# EAGLE design ProtoCAT (EAGLE 6.5.0)
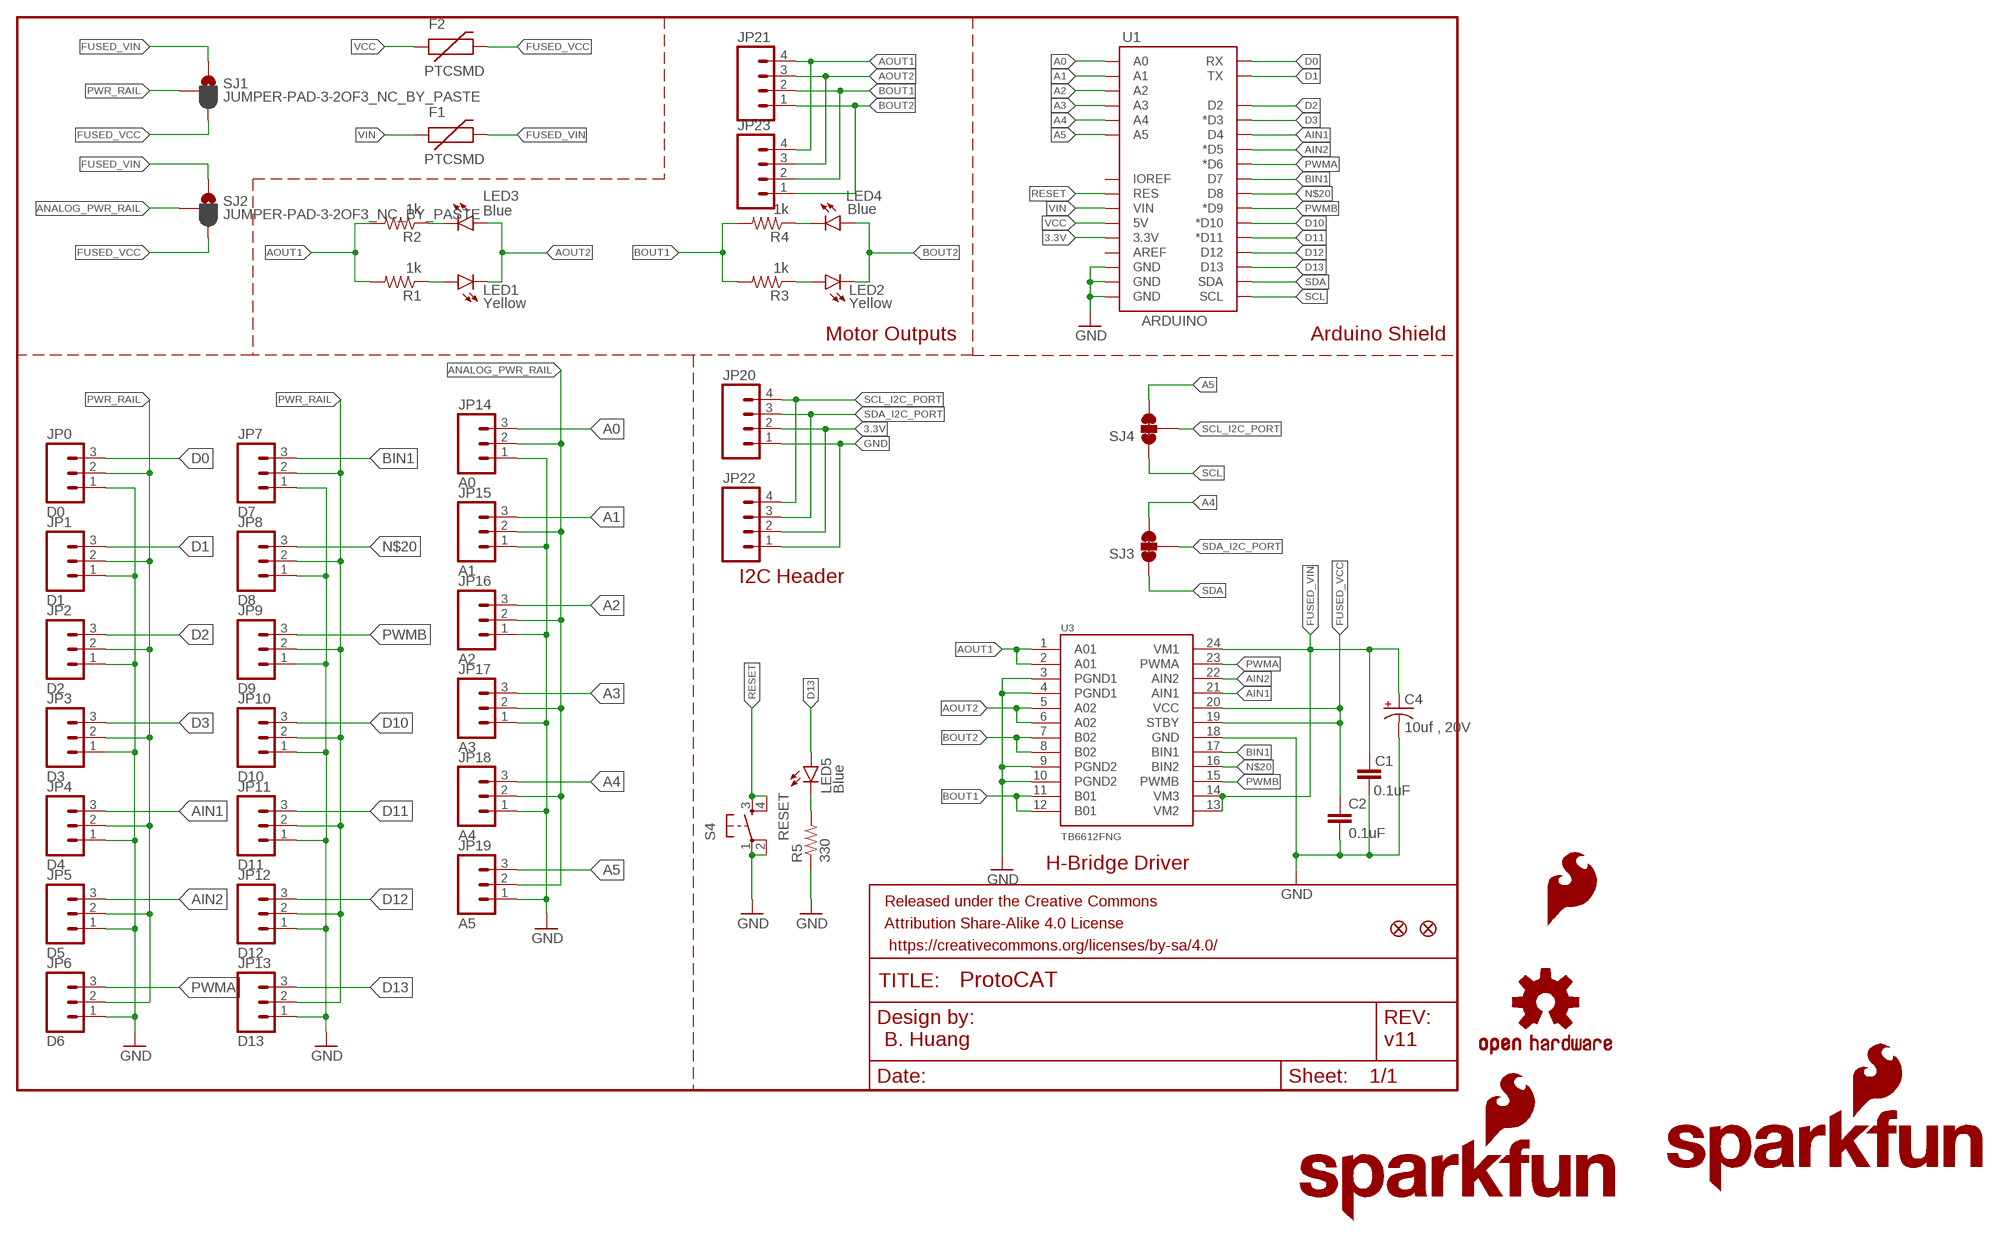
[diagram p0: schematic, sheet 1]

## Parts
C1  0.1uF  0.1UF-25V-5%(0603)  [0603-CAP]
C2  0.1uF  0.1UF-25V-5%(0603)  [0603-CAP]
C4  10uf , 20V  10UF-20V-10%(TANT)  [EIA3528]
F1  PTCSMD  [PTC-1206]
F2  PTCSMD  [PTC-1206]
FID1  FIDUCIAL1X2  [FIDUCIAL-1X2]
FID2  FIDUCIAL1X2  [FIDUCIAL-1X2]
FRAME1  FRAME-LETTER  [CREATIVE_COMMONS]
JP0  D0  M03LOCK  [1X03_LOCK]
JP1  D1  M03LOCK  [1X03_LOCK]
JP2  D2  M03LOCK  [1X03_LOCK]
JP3  D3  M03LOCK  [1X03_LOCK]
JP4  D4  M03LOCK  [1X03_LOCK]
JP5  D5  M03LOCK  [1X03_LOCK]
JP6  D6  M03LOCK  [1X03_LOCK]
JP7  D7  M03LOCK  [1X03_LOCK]
JP8  D8  M03LOCK  [1X03_LOCK]
JP9  D9  M03LOCK  [1X03_LOCK]
JP10  D10  M03LOCK  [1X03_LOCK]
JP11  D11  M03LOCK  [1X03_LOCK]
JP12  D12  M03LOCK  [1X03_LOCK]
JP13  D13  M03LOCK  [1X03_LOCK]
JP14  A0  M03LOCK  [1X03_LOCK]
JP15  A1  M03LOCK  [1X03_LOCK]
JP16  A2  M03LOCK  [1X03_LOCK]
JP17  A3  M03LOCK  [1X03_LOCK]
JP18  A4  M03LOCK  [1X03_LOCK]
JP19  A5  M03LOCK  [1X03_LOCK]
JP20  M04SMD_STRAIGHT_COMBO  [1X04_SMD_STRAIGHT_COMBO]
JP21  M04PTH  [1X04]
JP22  M04PTH  [1X04]
JP23  M04SMD_STRAIGHT_COMBO  [1X04_SMD_STRAIGHT_COMBO]
LED1  Yellow  LED0603  [LED-0603]
LED2  Yellow  LED0603  [LED-0603]
LED3  Blue  LED0603  [LED-0603]
LED4  Blue  LED0603  [LED-0603]
LED5  Blue  LED0603  [LED-0603]
LOGO1  OSHW-LOGOM  [OSHW-LOGO-M]
LOGO2  SFE_LOGO_NAME_FLAME.1_INCH  [SFE_LOGO_NAME_FLAME_.1]
LOGO3  SFE_LOGO_FLAME.2COP  [SFE_LOGO_FLAME_COPPER_.2]
LOGO4  SFE_LOGO_NAME_FLAME.1_INCH  [SFE_LOGO_NAME_FLAME_.1]
R1  1k  1KOHM1/10W1%(0603)  [0603-RES]
R2  1k  1KOHM1/10W1%(0603)  [0603-RES]
R3  1k  1KOHM1/10W1%(0603)  [0603-RES]
R4  1k  1KOHM1/10W1%(0603)  [0603-RES]
R5  330  330OHM1/10W1%(0603)  [0603-RES]
S4  RESET  TAC_SWITCHSMD  [TACTILE-SWITCH-SMD]
SJ1  JUMPER-PAD-3-2OF3_NC_BY_PASTE  [PAD-JUMPER-3-2OF3_NC_BY_PASTE_YES_SILK_FULL_BOX]
SJ2  JUMPER-PAD-3-2OF3_NC_BY_PASTE  [PAD-JUMPER-3-2OF3_NC_BY_PASTE_YES_SILK_FULL_BOX]
SJ3  JUMPER-PAD-3-NC_BY_TRACE  [PAD-JUMPER-3-3OF3_NC_BY_TRACE_YES_SILK_FULL_BOX]
SJ4  JUMPER-PAD-3-NC_BY_TRACE  [PAD-JUMPER-3-3OF3_NC_BY_TRACE_YES_SILK_FULL_BOX]
U1  ARDUINO  ARDUINO_R3_SHIELDNOLABELS  [UNO_R3_SHIELD_NOLABELS]
U3  TB6612FNG  [SSOP24]
U$1  SFE_LUDUS  [SFE_LUDUS-M]

## Nets
3.3V: JP20.2 JP22.2 U1.3.3V
A0: JP14.3 U1.A0
A1: JP15.3 U1.A1
A2: JP16.3 U1.A2
A3: JP17.3 U1.A3
A4: JP18.3 SJ3.3 U1.A4
A5: JP19.3 SJ4.3 U1.A5
AIN1: JP4.3 U1.D4 U3.21(AIN1)
AIN2: JP5.3 U1.D5(*D5) U3.22(AIN2)
ANALOG_PWR_RAIL: JP14.2 JP15.2 JP16.2 JP17.2 JP18.2 JP19.2 SJ2.2
AOUT1: JP21.4 JP23.4 R1.2 R2.2 U3.1(A01) U3.2(A01)
AOUT2: JP21.3 JP23.3 LED1.C LED3.A U3.5(A02) U3.6(A02)
BIN1: JP7.3 U1.D7 U3.17(BIN1)
BOUT1: JP21.2 JP23.2 R3.2 R4.2 U3.11(B01) U3.12(B01)
BOUT2: JP21.1 JP23.1 LED2.C LED4.A U3.7(B02) U3.8(B02)
D0: JP0.3 U1.RX
D1: JP1.3 U1.TX
D2: JP2.3 U1.D2
D3: JP3.3 U1.D3(*D3)
D10: JP10.3 U1.D10(*D10)
D11: JP11.3 U1.D11(*D11)
D12: JP12.3 U1.D12
D13: JP13.3 LED5.A U1.D13
FUSED_VCC: C2.1 F2.2 SJ1.3 SJ2.3 U3.19(STBY) U3.20(VCC)
FUSED_VIN: C1.1 C4.A(+) F1.2 SJ1.1 SJ2.1 U3.13(VM2) U3.14(VM3) U3.24(VM1)
GND: C1.2 C2.2 C4.C(-) JP0.1 JP1.1 JP2.1 JP3.1 JP4.1 JP5.1 JP6.1 JP7.1 JP8.1 JP9.1 JP10.1 JP11.1 JP12.1 JP13.1 JP14.1 JP15.1 JP16.1 JP17.1 JP18.1 JP19.1 JP20.1 JP22.1 R5.1 S4.1 S4.2 U1.GND@0(GND) U1.GND@1(GND) U1.GND@2(GND) U3.3(PGND1) U3.4(PGND1) U3.9(PGND2) U3.10(PGND2) U3.18(GND)
N$1: LED5.C R5.2
N$4: LED1.A R1.1
N$5: LED3.C R2.1
N$8: LED2.A R3.1
N$9: LED4.C R4.1
N$20: JP8.3 U1.D8 U3.16(BIN2)
PWMA: JP6.3 U1.D6(*D6) U3.23(PWMA)
PWMB: JP9.3 U1.D9(*D9) U3.15(PWMB)
PWR_RAIL: JP0.2 JP1.2 JP2.2 JP3.2 JP4.2 JP5.2 JP6.2 JP7.2 JP8.2 JP9.2 JP10.2 JP11.2 JP12.2 JP13.2 SJ1.2
RESET: S4.3 S4.4 U1.RES
SCL: SJ4.1 U1.SCL
SCL_I2C_PORT: JP20.4 JP22.4 SJ4.2
SDA: SJ3.1 U1.SDA
SDA_I2C_PORT: JP20.3 JP22.3 SJ3.2
VCC: F2.1 U1.5V
VIN: F1.1 U1.VIN
Unconnected: U1.AREF U1.IOREF

## Notes on the sheet
- Motor Outputs | Arduino Shield
- I2C Header
- H-Bridge Driver
- B. Huang | v11

## Library data of the parts
C1 C2 = SparkFun-Capacitors:0.1UF-25V-5%(0603): CAP-08604; PROD_ID: CAP-08604
C4 = SparkFun-Capacitors:10UF-20V-10%(TANT): CAP-08063; PROD_ID: CAP-08063; VALUE: 10uF
F1 F2 = SparkFun-PowerIC:PTC: Resettable Fuse PTC Resettable Fuse. Spark Fun Electronics SKU : COM-08357; PROD_ID: RES-11150
FID1 FID2 = SparkFun-Aesthetics:FIDUCIAL: Fiducial Alignment Points Various fiducial points for machine vision alignment.
FRAME1 = SparkFun-Aesthetics:FRAME-LETTER: Schematic Frame Standard 8.5x11 US Letter frame
JP0 JP1-JP19 = SparkFun-Connectors:M03: Header 3 Standard 3-pin 0.1" header. Use with straight break away headers (SKU : PRT-00116), right angle break away headers (PRT-00553), swiss pins (PRT-00743), machine pins (PRT-00117), and female headers (PRT-00115). Molex polarized connector foot print use with SKU : PRT-08232 with associated crimp pins and housings.
JP20 JP23 = SparkFun-Connectors:M04: Header 4 Standard 4-pin 0.1" header. Use with straight break away headers (SKU : PRT-00116), right angle break away headers (PRT-00553), swiss pins (PRT-00743), machine pins (PRT-00117), and female headers (PRT-00115). Molex polarized connector foot print use with SKU : PRT-08231 with associated crimp pins and housings. 1MM SMD Version SKU: PRT-10208; PROD_ID: CONN-08511; VALUE: 1X04_SMD_STRAIGHT_COMBO
JP21 JP22 = SparkFun-Connectors:M04: Header 4 Standard 4-pin 0.1" header. Use with straight break away headers (SKU : PRT-00116), right angle break away headers (PRT-00553), swiss pins (PRT-00743), machine pins (PRT-00117), and female headers (PRT-00115). Molex polarized connector foot print use with SKU : PRT-08231 with associated crimp pins and housings. 1MM SMD Version SKU: PRT-10208
LED1-LED5 = SparkFun-LED:LED: LEDs Standard schematic elements and footprints for 5mm, 3mm, 1206, and 0603 sized LEDs. 5mm - Spark Fun Electronics SKU : COM-00529 (and others)
LOGO1 = SparkFun-Aesthetics:OSHW-LOGO: Open Source Hardware Logo This logo indicates the piece of hardware it is found on incorporates a OSHW license and/or adheres to the definition of open source hardware found here: http://freedomdefined.org/OSHW
LOGO2 LOGO4 = SparkFun-Aesthetics:SFE_LOGO_NAME_FLAME: SFE Logo, name and flame This is the SparkFun full logo. The logo on the schematic will always be the same size; the package variant is the height of the flame part of the logo. Default layer for the logo on the board is tSilk.
LOGO3 = SparkFun-Aesthetics:SFE_LOGO_FLAME: SFE Logo, flame only This is the SparkFun flame logo. The logo on the schematic will always be the same size; the package variant is the height of the flame. Default layer for the logo on the board is tSilk.
R1-R4 = SparkFun-Resistors:1KOHM1/10W1%(0603): RES-07856; PROD_ID: RES-07856; VALUE: 1K
R5 = SparkFun-Resistors:330OHM1/10W1%(0603): RES-00818; PROD_ID: RES-00818
S4 = SparkFun-Electromechanical:TAC_SWITCH: Momentary Switch Button commonly used for reset or general input. Spark Fun Electronics SKU : COM-00097 SMT- SWCH-08247; PROD_ID: SWCH-08247; VALUE: TAC_SWITCHSMD
SJ1 SJ2 = SparkFun-Passives:JUMPER-PAD-3-2OF3_NC_BY_PASTE
SJ3 SJ4 = SparkFun-Passives:JUMPER-PAD-3-NC_BY_TRACE
U1 = SparkFun-Boards:ARDUINO_R3_SHIELD: Shield form compatible with the Arduino Uno R3.
U3 = SparkFun-PowerIC:TB6612FNG: Toshiba 1A dual motor driver IC-09363; PROD_ID: IC-09363
U$1 = SparkFun-Aesthetics:SFE_LUDUS

## Net classes
1 power: width 0.61 mm

## Board
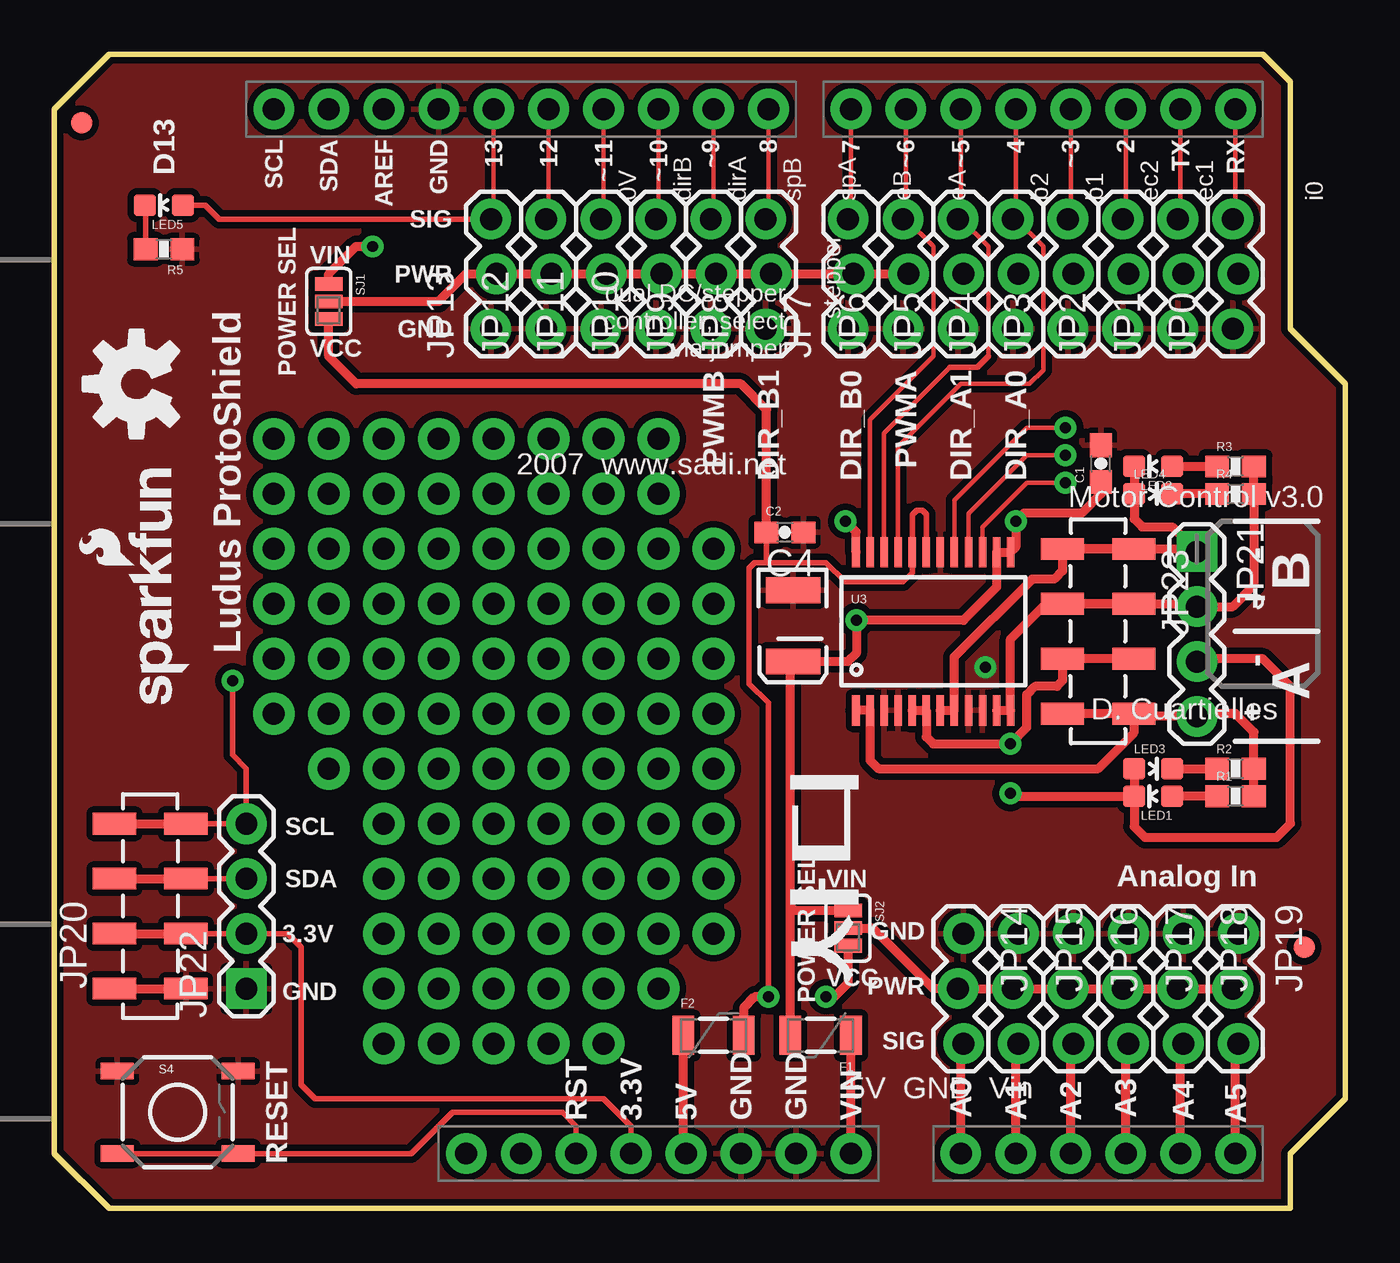
[diagram p1: board, top side]
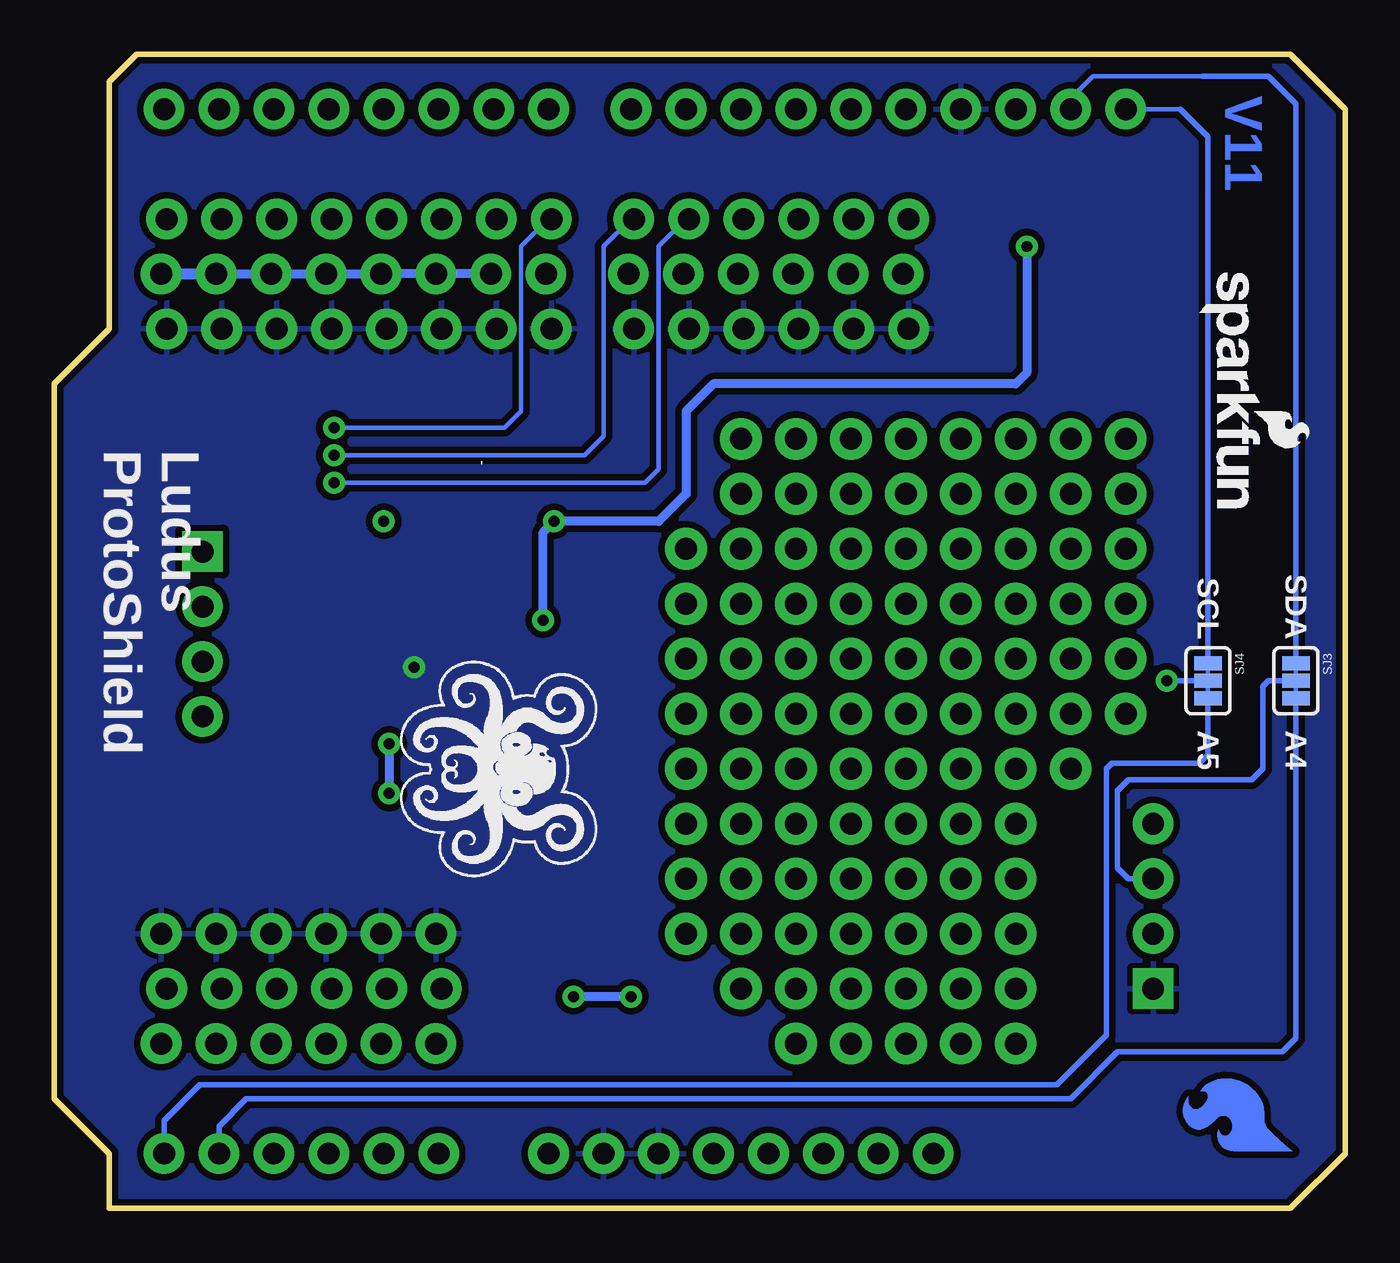
[diagram p2: board, bottom side, seen from below]

Size 59.69 x 53.34 mm. Coordinates in mm from the lower left corner, seen from the top.
Outline: 0,50.8 0,2.54 2.54,0 57.15,0 57.15,2.54 59.69,5.08 59.69,38.1 57.15,40.64 57.15,52.07 55.88,53.34 2.54,53.34 0,50.8
Copper layers (1*16): Top 0.035mm / dielectric 1.5mm / Bottom 0.035mm
Design rules "SparkFun-2-layer": minimum track width 7mil, minimum drill 15mil, track to track 8mil, track to pad 8mil, pad to pad 8mil, via to via 8mil, smd to smd 8mil, copper to edge 8mil, drill to drill 8mil, minimum pad ring 12mil, minimum via ring 10mil, stop-mask expansion 4mil, vias tented up to drill 20mil, thermal gap 10mil

### Footprints (pad centres in the part's own frame; a part is rotated, then mirrored left to right if it is on the bottom)
0603-CAP = smd 1.1 x 1: 1 -0.85,0; 2 0.85,0
EIA3528 = smd 1.2 x 2.5: A 1.65,0; C -1.65,0
PTC-1206 = smd 1 x 1.8: 1 -1.4,0; 2 1.4,0
FIDUCIAL-1X2 = smd 1 x 1: 1 0,0
1X03_LOCK = drill 1.016 pad 1.88: 1 0,0.127; 2 2.54,-0.127; 3 5.08,0.127
1X04_SMD_STRAIGHT_COMBO = smd 1 x 2: 1 0,-1.65; 1-2 0,1.65; 2 2.54,1.65; 2-2 2.54,-1.65; 3 5.08,-1.65; 3-2 5.08,1.65; 4 7.62,1.65; 4-2 7.62,-1.65
1X04 = drill 1.016 pad 1.88 square: 1 0,0 | drill 1.016 pad 1.88: 2 2.54,0; 3 5.08,0; 4 7.62,0
LED-0603 = smd 1 x 1: A 0,-0.877; C 0,0.877
0603-RES = smd 1.1 x 1: 1 -0.85,0; 2 0.85,0
TACTILE-SWITCH-SMD = smd 1.524 x 0.762: 1 -2.794,1.905; 2 2.794,1.905; 3 -2.794,-1.905; 4 2.794,-1.905
PAD-JUMPER-3-2OF3_NC_BY_PASTE_YES_SILK_FULL_BOX = smd 0.635 x 1.27: 1 -0.813,0; 2 0,0; 3 0.813,0
PAD-JUMPER-3-3OF3_NC_BY_TRACE_YES_SILK_FULL_BOX = smd 0.635 x 1.27: 1 -0.813,0; 2 0,0; 3 0.813,0
UNO_R3_SHIELD_NOLABELS = drill 1.016 pad 1.88: 3.3V 50.8,26.67; 5V 50.8,29.21; A0 50.8,41.91; A1 50.8,44.45; A2 50.8,46.99; A3 50.8,49.53; A4 50.8,52.07; A5 50.8,54.61; AREF 2.54,15.24; D2 2.54,49.53; D3 2.54,46.99; D4 2.54,44.45; D5 2.54,41.91; D6 2.54,39.37; D7 2.54,36.83; D8 2.54,33.02; D9 2.54,30.48; D10 2.54,27.94; D11 2.54,25.4; D12 2.54,22.86; D13 2.54,20.32; GND@0 50.8,31.75; GND@1 50.8,34.29; GND@2 2.54,17.78; IOREF 50.8,21.59; NC 50.8,19.05; RES 50.8,24.13; RX 2.54,54.61; SCL 2.54,10.16; SDA 2.54,12.7; TX 2.54,52.07; VIN 50.8,36.83
SSOP24 = smd 0.348 x 1.397: 1 -3.575,-3.656; 2 -2.925,-3.656; 3 -2.275,-3.656; 4 -1.625,-3.656; 5 -0.975,-3.656; 6 -0.325,-3.656; 7 0.325,-3.656; 8 0.975,-3.656; 9 1.625,-3.656; 10 2.275,-3.656; 11 2.925,-3.656; 12 3.575,-3.656; 13 3.575,3.656; 14 2.925,3.656; 15 2.275,3.656; 16 1.625,3.656; 17 0.975,3.656; 18 0.325,3.656; 19 -0.325,3.656; 20 -0.975,3.656; 21 -1.625,3.656; 22 -2.275,3.656; 23 -2.925,3.656; 24 -3.575,3.656

### Placement (x,y rotation side)
C1  48.39,34.42 90 top
C2  33.78,31.24 0 top
C4  34.16,26.92 270 top
F1  35.43,8 180 top
F2  30.48,8 0 top
FID1  1.27,50.16 0 top
FID2  57.78,12.06 0 top
FRAME1  21.59,-12.7 0 top  (outside the outline)
JP0  54.61,40.64 90 top
JP1  52.07,40.64 90 top
JP2  49.53,40.64 90 top
JP3  46.99,40.64 90 top
JP4  44.45,40.64 90 top
JP5  41.91,40.64 90 top
JP6  39.37,40.64 90 top
JP7  36.83,40.64 90 top
JP8  33.02,40.64 90 top
JP9  30.48,40.64 90 top
JP10  27.94,40.64 90 top
JP11  25.4,40.64 90 top
JP12  22.86,40.64 90 top
JP13  20.32,40.64 90 top
JP14  41.91,12.7 270 top
JP15  44.45,12.7 270 top
JP16  46.99,12.7 270 top
JP17  49.53,12.7 270 top
JP18  52.07,12.7 270 top
JP19  54.61,12.7 270 top
JP20  4.45,10.16 90 top
JP21  52.83,30.35 270 top
JP22  8.89,10.16 90 top
JP23  48.26,30.48 270 top
LED1  50.8,19.05 90 top
LED2  50.8,34.29 90 top
LED3  50.8,20.32 270 top
LED4  50.8,33.02 270 top
LED5  5.08,46.35 90 top
LOGO1  3.81,38.1 90 top
LOGO2  6.35,22.86 90 top
LOGO3  2.16,2.29 90 bottom
LOGO4  6.86,43.69 270 bottom
R1  54.61,19.05 0 top
R2  54.61,20.32 0 top
R3  54.61,34.29 0 top
R4  54.61,33.02 0 top
R5  5.08,44.32 180 top
S4  5.71,4.45 0 top
SJ1  12.7,41.91 270 top
SJ2  36.7,12.95 270 top
SJ3  2.29,24.38 270 bottom
SJ4  6.35,24.38 270 bottom
U1  0,53.34 270 top
U3  40.64,26.67 0 top
U$1  39.37,20.32 90 top

### Tracks (layer width: path | path; a pad name or v marks a point on that pad's centre or on a via)
3.3V
  Top 0.254: U1.3.3V 26.67,3.81 25.4,5.08 12.06,5.08 11.43,5.71 11.43,12.06 10.79,12.7 JP22.2 JP20.2
A0
  Top 0.406: U1.A0 41.91,7.49 JP14.3
A1
  Top 0.406: U1.A1 44.45,7.49 JP15.3
A2
  Top 0.406: U1.A2 46.99,7.49 JP16.3
A3
  Top 0.406: U1.A3 49.53,7.49 JP17.3
A4
  Top 0.406: U1.A4 52.07,7.49 JP18.3
  Bottom 0.254: U1.A4 52.07,3.81 50.8,5.08 12.7,5.08 10.54,7.24 2.92,7.24 2.29,7.87 SJ3.3
A5
  Top 0.406: U1.A5 54.61,7.49 JP19.3
  Bottom 0.254: U1.A5 54.61,4.06 52.96,5.71 13.34,5.71 11.05,8 11.05,20.32 10.79,20.57 6.73,20.57 6.35,20.95 SJ4.3
AIN1
  Top 0.203: U3.21 39.02,35.2 41.91,38.1 45.09,38.1 45.72,38.73 45.72,44.45 44.45,45.72 JP4.3 44.45,45.85 U1.D4
AIN2
  Top 0.203: U3.22 38.37,35.83 41.4,38.86 | 43.18,39.37 43.18,44.45 41.91,45.72 JP5.3 41.91,45.85 U1.D5
  Top 0.254: 43.18,39.37 42.67,38.86 41.4,38.86
ANALOG_PWR_RAIL
  Top 0.406: JP19.2 JP18.2 JP17.2 JP16.2 JP15.2 JP14.2 40.64,10.16 37.85,12.95 SJ2.2
AOUT1
  Top 0.254: 55.24,18.84 R1.2
  Top 0.406: R1.2 R2.2 55.46,22.01 54.61,22.86 52.96,22.86 JP21.4 50.04,22.73 JP23.4 49.91,21.97 48.26,20.32 38.1,20.32 37.72,20.7 U3.2 U3.1
AOUT2  (via drill 0.51)
  Top 0.406: LED3.A LED1.C | LED1.C 49.92,17.64 50.42,17.14 56.52,17.14 57.15,17.78 57.15,24.13 55.88,25.4 52.96,25.4 JP21.3 | U3.5 U3.6 40.31,21.79 40.64,21.46 v44.2,21.46 44.96,22.23 44.96,23.75 45.34,24.13 46.35,24.13 46.61,24.39 JP23.3 | v44.2,19.18 44.32,19.05 LED1.C
  Bottom 0.406: v44.2,21.46 v44.2,19.18
BIN1  (via drill 0.51)
  Top 0.203: U3.17 41.62,32.73 44.96,36.07 v46.76,36.07 | U1.D7 36.83,45.85 JP7.3
  Bottom 0.203: v46.76,36.07 38.86,36.07 38.1,36.83 38.1,44.45 36.83,45.72 JP7.3
BOUT1
  Top 0.406: R3.2 R4.2 55.46,28.79 54.48,27.81 JP21.2 52.7,27.94 JP23.2 45.85,27.94 44.22,26.31 U3.12 U3.11
BOUT2
  Top 0.406: U3.7 U3.8 41.62,25.49 45.21,29.08 46.23,29.08 46.61,29.46 JP23.1 52.7,30.48 JP21.1 51.69,31.5 50.29,31.5 49.92,31.86 LED4.A LED2.C
D0
  Top 0.203: U1.RX 54.61,45.85 JP0.3
D1
  Top 0.203: U1.TX 52.07,45.85 JP1.3
D2
  Top 0.203: U1.D2 49.53,45.85 JP2.3
D3
  Top 0.203: U1.D3 46.99,45.85 JP3.3
D10
  Top 0.203: U1.D10 27.94,45.85 JP10.3
D11
  Top 0.203: U1.D11 25.4,45.85 JP11.3
D12
  Top 0.203: U1.D12 22.86,45.85 JP12.3
D13
  Top 0.203: U1.D13 20.32,45.85 JP13.3
  Top 0.254: LED5.A 6.99,46.35 7.62,45.72 JP13.3
FUSED_VCC  (via drill 0.51)
  Top 0.254: v33.02,9.78 33.02,23.37 32.13,24.26 32.13,29.59 32.38,29.84 33.02,29.84 | 33.02,29.84 35.69,29.84 36.58,28.96 39.24,28.96 39.66,29.38 U3.20 39.66,32.05 39.88,32.26 40.13,32.26 40.31,32.08 U3.19 | C2.1 32.93,29.93 33.02,29.84
  Top 0.406: F2.2 31.88,9.27 32.38,9.78 v33.02,9.78 | v35.69,9.78 36.07,9.78 36.7,10.41 SJ2.3 | C2.1 32.93,36.92 31.75,38.1 13.97,38.1 12.7,39.37 SJ1.3
  Bottom 0.406: v33.02,9.78 v35.69,9.78
FUSED_VIN  (via drill 0.51)
  Top 0.406: C1.1 48.39,33.02 47.5,32.13 44.83,32.13 v44.45,31.75 44.45,30.56 U3.13 U3.14 43.56,28.71 42.04,27.18 v37.08,27.18 37.08,25.65 36.7,25.27 C4.A 34.03,25.14 34.03,13.97 | SJ1.1 12.7,43.18 13.97,44.45 v14.73,44.45 | F1.2 34.03,13.97 | U3.24 37.06,31.26 v36.58,31.75 | SJ2.1 34.24,13.77 34.03,13.97
  Bottom 0.406: v14.73,44.45 14.73,38.61 15.24,38.1 29.21,38.1 30.48,36.83 30.48,33.02 31.75,31.75 v36.58,31.75 37.08,31.24 v37.08,27.18
GND  (via drill 0.51)
  other vias: 43.05,25.02
  pour Top (isolate 0.305): 0,53.34 0,0 59.69,0 59.69,53.34
  pour Bottom (isolate 0.305): 0,0 59.69,0 59.69,53.34 0,53.34
N$1
  Top 0.254: R5.2 4.23,46.33 LED5.C
N$2  (via drill 1.02 pad 1.93)
  other vias: 25.4,35.56
N$3  (via drill 1.02 pad 1.93)
  other vias: 25.4,33.02
N$4
  Top 0.406: R1.1 LED1.A
N$5
  Top 0.406: LED3.C R2.1
N$6  (via drill 1.02 pad 1.93)
  other vias: 25.4,30.48
N$7  (via drill 1.02 pad 1.93)
  other vias: 22.86,30.48
N$8
  Top 0.406: LED2.A R3.1
N$9
  Top 0.406: R4.1 LED4.C
N$10  (via drill 1.02 pad 1.93)
  other vias: 22.86,33.02
N$11  (via drill 1.02 pad 1.93)
  other vias: 22.86,35.56
N$12  (via drill 1.02 pad 1.93)
  other vias: 20.32,35.56
N$13  (via drill 1.02 pad 1.93)
  other vias: 17.78,35.56
N$14  (via drill 1.02 pad 1.93)
  other vias: 15.24,35.56
N$15  (via drill 1.02 pad 1.93)
  other vias: 12.7,35.56
N$16  (via drill 1.02 pad 1.93)
  other vias: 10.16,35.56
N$17  (via drill 1.02 pad 1.93)
  other vias: 27.94,35.56
N$18  (via drill 1.02 pad 1.93)
  other vias: 12.7,20.32
N$19  (via drill 1.02 pad 1.93)
  other vias: 27.94,10.16
N$20  (via drill 0.51)
  Top 0.203: U3.16 42.27,32.1 44.96,34.8 v46.76,34.8 | U1.D8 33.02,45.85 JP8.3
  Bottom 0.203: v46.76,34.8 35.18,34.8 34.29,35.69 34.29,44.45 33.02,45.72 JP8.3
N$23  (via drill 1.02 pad 1.93)
  other vias: 10.16,22.86
N$24  (via drill 1.02 pad 1.93)
  other vias: 10.16,25.4
N$25  (via drill 1.02 pad 1.93)
  other vias: 12.7,25.4
N$26  (via drill 1.02 pad 1.93)
  other vias: 15.24,25.4
N$27  (via drill 1.02 pad 1.93)
  other vias: 17.78,25.4
N$28  (via drill 1.02 pad 1.93)
  other vias: 20.32,25.4
N$29  (via drill 1.02 pad 1.93)
  other vias: 22.86,25.4
N$30  (via drill 1.02 pad 1.93)
  other vias: 25.4,25.4
N$31  (via drill 1.02 pad 1.93)
  other vias: 27.94,25.4
N$32  (via drill 1.02 pad 1.93)
  other vias: 27.94,27.94
N$33  (via drill 1.02 pad 1.93)
  other vias: 27.94,30.48
N$34  (via drill 1.02 pad 1.93)
  other vias: 27.94,33.02
N$35  (via drill 1.02 pad 1.93)
  other vias: 25.4,27.94
N$36  (via drill 1.02 pad 1.93)
  other vias: 22.86,27.94
N$37  (via drill 1.02 pad 1.93)
  other vias: 20.32,27.94
N$38  (via drill 1.02 pad 1.93)
  other vias: 17.78,27.94
N$39  (via drill 1.02 pad 1.93)
  other vias: 15.24,27.94
N$40  (via drill 1.02 pad 1.93)
  other vias: 12.7,27.94
N$41  (via drill 1.02 pad 1.93)
  other vias: 10.16,27.94
N$42  (via drill 1.02 pad 1.93)
  other vias: 12.7,22.86
N$45  (via drill 1.02 pad 1.93)
  other vias: 10.16,33.02
N$46  (via drill 1.02 pad 1.93)
  other vias: 10.16,30.48
N$47  (via drill 1.02 pad 1.93)
  other vias: 12.7,30.48
N$48  (via drill 1.02 pad 1.93)
  other vias: 12.7,33.02
N$49  (via drill 1.02 pad 1.93)
  other vias: 15.24,33.02
N$50  (via drill 1.02 pad 1.93)
  other vias: 15.24,30.48
N$51  (via drill 1.02 pad 1.93)
  other vias: 17.78,30.48
N$52  (via drill 1.02 pad 1.93)
  other vias: 17.78,33.02
N$53  (via drill 1.02 pad 1.93)
  other vias: 20.32,33.02
N$54  (via drill 1.02 pad 1.93)
  other vias: 20.32,30.48
N$55  (via drill 1.02 pad 1.93)
  other vias: 15.24,22.86
N$56  (via drill 1.02 pad 1.93)
  other vias: 15.24,20.32
N$57  (via drill 1.02 pad 1.93)
  other vias: 15.24,17.78
N$58  (via drill 1.02 pad 1.93)
  other vias: 15.24,15.24
N$59  (via drill 1.02 pad 1.93)
  other vias: 15.24,12.7
N$60  (via drill 1.02 pad 1.93)
  other vias: 15.24,10.16
N$61  (via drill 1.02 pad 1.93)
  other vias: 15.24,7.62
N$62  (via drill 1.02 pad 1.93)
  other vias: 17.78,7.62
N$63  (via drill 1.02 pad 1.93)
  other vias: 20.32,7.62
N$64  (via drill 1.02 pad 1.93)
  other vias: 22.86,7.62
N$65  (via drill 1.02 pad 1.93)
  other vias: 25.4,7.62
N$66  (via drill 1.02 pad 1.93)
  other vias: 25.4,10.16
N$67  (via drill 1.02 pad 1.93)
  other vias: 22.86,10.16
N$68  (via drill 1.02 pad 1.93)
  other vias: 20.32,10.16
N$69  (via drill 1.02 pad 1.93)
  other vias: 17.78,10.16
N$70  (via drill 1.02 pad 1.93)
  other vias: 17.78,12.7
N$71  (via drill 1.02 pad 1.93)
  other vias: 20.32,12.7
N$72  (via drill 1.02 pad 1.93)
  other vias: 22.86,12.7
N$73  (via drill 1.02 pad 1.93)
  other vias: 25.4,12.7
N$74  (via drill 1.02 pad 1.93)
  other vias: 27.94,12.7
N$76  (via drill 1.02 pad 1.93)
  other vias: 27.94,15.24
N$77  (via drill 1.02 pad 1.93)
  other vias: 27.94,17.78
N$78  (via drill 1.02 pad 1.93)
  other vias: 27.94,20.32
N$79  (via drill 1.02 pad 1.93)
  other vias: 27.94,22.86
N$80  (via drill 1.02 pad 1.93)
  other vias: 25.4,22.86
N$81  (via drill 1.02 pad 1.93)
  other vias: 25.4,20.32
N$82  (via drill 1.02 pad 1.93)
  other vias: 25.4,17.78
N$83  (via drill 1.02 pad 1.93)
  other vias: 25.4,15.24
N$84  (via drill 1.02 pad 1.93)
  other vias: 22.86,15.24
N$85  (via drill 1.02 pad 1.93)
  other vias: 22.86,17.78
N$86  (via drill 1.02 pad 1.93)
  other vias: 22.86,20.32
N$87  (via drill 1.02 pad 1.93)
  other vias: 22.86,22.86
N$88  (via drill 1.02 pad 1.93)
  other vias: 20.32,22.86
N$89  (via drill 1.02 pad 1.93)
  other vias: 20.32,20.32
N$90  (via drill 1.02 pad 1.93)
  other vias: 20.32,17.78
N$91  (via drill 1.02 pad 1.93)
  other vias: 20.32,15.24
N$92  (via drill 1.02 pad 1.93)
  other vias: 17.78,15.24
N$93  (via drill 1.02 pad 1.93)
  other vias: 17.78,17.78
N$94  (via drill 1.02 pad 1.93)
  other vias: 17.78,20.32
N$95  (via drill 1.02 pad 1.93)
  other vias: 17.78,22.86
N$96  (via drill 1.02 pad 1.93)
  other vias: 30.48,30.48
N$97  (via drill 1.02 pad 1.93)
  other vias: 30.48,27.94
N$98  (via drill 1.02 pad 1.93)
  other vias: 30.48,25.4
N$99  (via drill 1.02 pad 1.93)
  other vias: 30.48,22.86
N$100  (via drill 1.02 pad 1.93)
  other vias: 30.48,20.32
N$101  (via drill 1.02 pad 1.93)
  other vias: 30.48,17.78
N$102  (via drill 1.02 pad 1.93)
  other vias: 30.48,15.24
N$103  (via drill 1.02 pad 1.93)
  other vias: 30.48,12.7
PWMA
  Top 0.203: U3.23 37.72,36.45 40.64,39.37 40.64,44.45 39.37,45.72 JP6.3 39.37,45.85 U1.D6
PWMB  (via drill 0.51)
  Top 0.203: U3.15 42.91,31.48 44.96,33.53 v46.76,33.53 | U1.D9 30.48,45.85 JP9.3
  Bottom 0.203: v46.76,33.53 32.38,33.53 31.75,34.16 31.75,44.45 30.48,45.72 JP9.3
PWR_RAIL
  Top 0.406: SJ1.2 17.78,41.91 19.05,43.18 JP13.2 JP12.2 JP11.2 JP10.2 JP9.2 JP8.2 JP7.2 JP6.2
  Bottom 0.406: JP6.2 JP5.2 JP4.2 JP3.2 JP2.2 JP1.2
  Bottom 0.508: JP0.2 JP1.2
RESET
  Top 0.254: S4.3 S4.4 16.51,2.54 18.41,4.45 23.5,4.45 24.13,3.81 U1.RES
SCL
  Bottom 0.203: U1.SCL 7.62,50.8
  Bottom 0.254: SJ4.1 6.35,49.53 7.62,50.8
SCL_I2C_PORT  (via drill 0.51)
  Top 0.254: JP20.4 JP22.4 8.89,20.32 8.26,20.95 v8.26,24.38
  Bottom 0.254: SJ4.2 v8.26,24.38
SDA
  Bottom 0.203: U1.SDA 12.7,51.31 11.68,52.32 6.6,52.32
  Bottom 0.254: SJ3.1 2.29,51.05 3.56,52.32 6.6,52.32
SDA_I2C_PORT
  Top 0.254: JP22.3 JP20.3
  Bottom 0.254: SJ3.2 3.56,24.38 3.81,24.13 3.81,20.32 4.32,19.81 10.03,19.81 10.54,19.3 10.54,15.75 10.03,15.24 JP22.3
VCC
  Top 0.406: F2.1 29.08,2.67 U1.5V
VIN
  Top 0.406: U1.VIN F1.1

### Text on the board
Bottom: V11
tPlace: SCL | SDA | AREF | GND | 13 | 12 | ~11 | ~10 | ~9 | 8 | 7 | ~6 | ~5 | 4 | ~3 | 2 | TX | RX | D13 | SIG | VIN | PWR | POWER SEL | GND | VCC | PWMB | DIR_B1 | DIR_B0 | PWMA | DIR_A1 | DIR_A0 | - | B | + | Ludus ProtoShield | - | A | + | SCL | Analog In | SDA | VIN | 3.3V | POWER SEL | GND | VCC | GND | PWR | SIG | RESET | RST | 3.3V | 5V | GND | GND | VIN | A0 | A1 | A2 | A3 | A4 | A5
bPlace: Ludus / ProtoShield | SDA | SCL | A4 | A5
tNames: 0V | dirB | dirA | spB | spA | eB | eA | b2 | b1 | ec2 | ec1 | i0 | dual DC/stepper | controller, select | stepper | via jumper | 2007 www.sadi.net | Motor Control v3.0 | D. Cuartielles | 5V GND Vin
tValues: L298P013TR
tDocu: B. Huang